# Altium schematic sheet 02-Power.SchDoc: ECE315 Analog
size A; Date: 4/25/2017; ApprovedBy: JSK; CheckedBy: JSK; Author: JSK; CompanyName: University of Wisconsin; DrawnBy: JSK; Engineer: JSK; Organization: ECE 315; Address1: College of Engineering; Address2: 1415 Engineering Drive; Address3: Madison, WI 53706; Address4: ECE 315 Fall 2017; Revision: A; SheetNumber: 2; SheetTotal: 2; AssemblyNumber: ECE315-F19; ApprovedDate: 04/02/2019
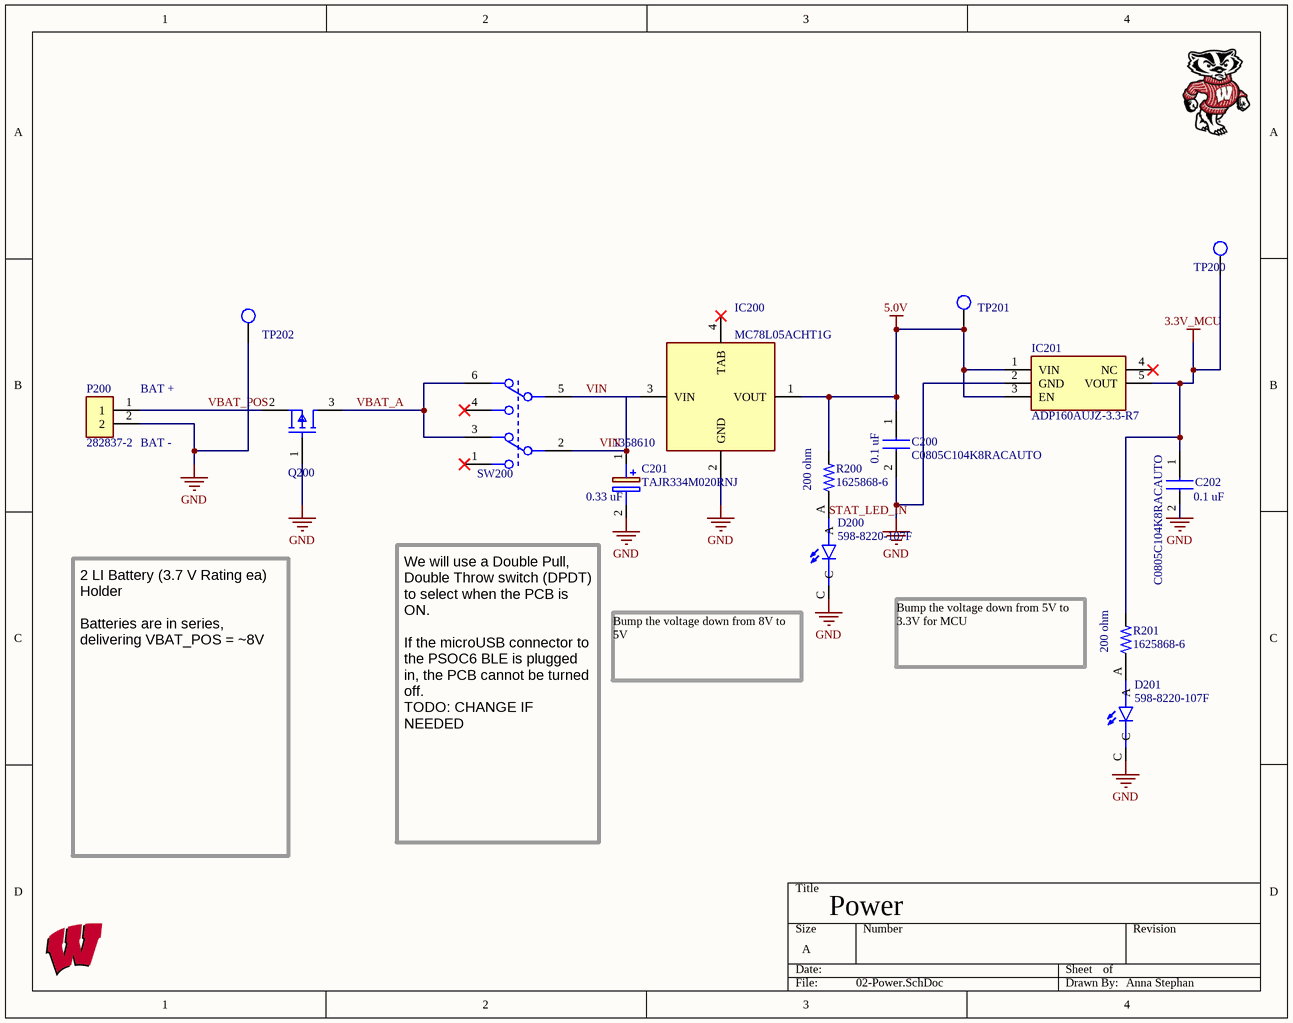
[diagram p0: 02-Power.SchDoc]

## Parts
C200  C0805C104K8RACAUTO  [CAPC2012X88N]
C201  TAJR334M020RNJ  Supplier Part Number 1: 1358610  [CAPM3216X18N]
C202  C0805C104K8RACAUTO  [CAPC2012X88N]
D200  598-8220-107F  [LEDSC160X320X90-2N]
D201  598-8220-107F  [LEDSC160X320X90-2N]
IC200  MC78L05ACHT1G  [SOT89-150P415X160-3N]
IC201  ADP160AUJZ-3.3-R7  [TSOT23127P600-8N]
P200  282837-2  [TE_282837-2]
Q200  SSM3J328R,LF  [SOT-23_M]  (value not drawn)
R200  1625868-6  [RESC2012X65N]
R201  1625868-6  [RESC2012X65N]
SW200  MHS22204  [C&K_Components_0_MFG]  (value not drawn)
TP200  TP_1206  [TP-SMC-1206]  (value not drawn)
TP201  TP_1206  [TP-SMC-1206]  (value not drawn)
TP202  TP_1206  [TP-SMC-1206]  (value not drawn)

## Nets
3.3V_MCU: C202.1 IC201.5(VOUT) R201.2 TP200.1
5.0V: C200.1 IC200.1(VOUT) IC201.1(VIN) IC201.3(EN) R200.2 TP201.1
GND: C200.2 C201.2(-) C202.2 D200.C D201.C IC200.2(GND) IC201.2(GND) P200.2 Q200.1(Gate) TP202.1
VBAT_A: Q200.3(Drain) SW200.3 SW200.6
VBAT_POS: P200.1 Q200.2(Source)
VIN: C201.1(+) IC200.3(VIN) SW200.2 SW200.5
NetD200_A: D200.A R200.1
NetD201_A: D201.A R201.1

Not connected (* = marked no-connect by the designer): IC200 4(TAB)*; IC201 4(NC)*; SW200 1* 4*

## Notes on the sheet
- (near P200) BAT +
- (near P200) BAT -
- (near C201) 0.33 uF
- (near R200) 200 ohm
- (near C200) 0.1 uF
- (near C202) 0.1 uF
- (near D200) Bump the voltage down from 8V to 5V
- Bump the voltage down from 5V to 3.3V for MCU
- (near R201) 200 ohm
- (near C201) We will use a Double Pull, Double Throw switch (DPDT) to select when the PCB is ON.
  If the microUSB connector to the PSOC6 BLE is plugged in, the PCB cannot be turned off.
  TODO: CHANGE IF NEEDED
- 2 LI Battery (3.7 V Rating ea) Holder
  Batteries are in series, delivering VBAT_POS = ~8V
- Power
- Anna Stephan
- Labels drawn without touching a wire or pin: STAT_LED_IN

## Library data of the parts
C200 C202 = C0805C104K8RACAUTO: Capacitor; Manufacturer_Name: Kemet; Datasheet Link: https://ad.componentsearchengine.com/Datasheets/2/C0805C104K8RACAUTO.pdf; Height: 0.88mm; Mouser2 Part Number: 80-C0805C104K8RAUTO; Manufacturer_Part_Number: C0805C104K8RACAUTO
C201 = TAJR334M020RNJ: Capacitor Polarised; Manufacturer_Name: AVX; Height: 1.2mm; Mouser2 Part Number: 581-TAJR334M020RNJ; Manufacturer_Part_Number: TAJR334M020RNJ; Supplier 1: RSComponents
D200 D201 = 598-8220-107F: Red 625nm LED Indication - Discrete 2V 1206 _3216 Metric_; MF: Dialight; Value: *; MP: 598-8220-107F; Package: 1206 Dialight; SnapEDA_Link: https://www.snapeda.com/parts/598-8220-107F/Dialight/view-part/454138/?ref=snap
IC200 = MC78L05ACHT1G: Integrated Circuit; Manufacturer_Name: ON Semiconductor; Datasheet Link: https://componentsearchengine.com//MC78L05ACHT1G.pdf; Mouser2 Part Number: 863-MC78L05ACHT1G; Mouser2 Price/Stock: https://www.mouser.com/Search/Refine.aspx?Keyword=863-MC78L05ACHT1G; Manufacturer_Part_Number: MC78L05ACHT1G
IC201 = ADP160AUJZ-3.0-R7: Integrated Circuit; Manufacturer_Name: Analog Devices; Datasheet Link: https://componentsearchengine.com/Datasheets/2/ADP160AUJZ-3.0-R7.pdf; Height: 1mm; Mouser2 Part Number: 584-ADP160AUJZ-3.3R7; Manufacturer_Part_Number: ADP160AUJZ-3.0-R7
P200 = 282837-2: Connector Terminal Blocks Receptacle 2 Position 5.08mm Solder Straight Thru-Hole 13.5A/Contact; Manufacturer: TE Connectivity AMP Connectors; MF: TE Connectivity; Price: None; Check_prices: https://www.snapeda.com/parts/282837-2/TE%20Connectivity%20AMP%20Connectors/view-part/2549980/?ref=eda; Package: None; Purchase-URL: https://pricing.snapeda.com/search/part/282837-2/?ref=eda; SnapEDA_Link: https://www.snapeda.com/parts/282837-2/TE%20Connectivity%20AMP%20Connectors/view-part/2549980/?ref=snap; Value: *; MP: 282837-2; Availability: Good; Manufacturer Part No.: 282837-2; Digikey Part No.: A113320-ND
Q200 = SSM3J328R,LF: MOSFET P-CH 20V 6A SOT23F; Manufacturer 1: Toshiba; Rds On Max: 29.8mR; Input Capacitance: 840pF; Max Power Dissipation: 1W; Gate to Source Voltage (Vgs): 8V; Turn-Off Delay Time: 107ns; Turn-On Delay Time: 32ns; Number of Channels: 1; Drain to Source Resistance: 47.4mR; Power Dissipation: 2W; Element Configuration: Single; Drain to Source Breakdown Voltage: -20V; Polarity: P-CHANNEL; Supplier 1: Digi-Key; Supplier Part Number 1: SSM3J328RLFCT-ND; Manufacturer Part Number 1: SSM3J328R,LF; RoHS: Yes; Category: MOSFETs; Stock 1: 476474; Pricing 1: 1=0.43000, 10=0.32200, 25=0.29040, 100=0.20060, 500=0.13728, 1000=0.10560 (USD); Mount: Surface Mount; Case/Package: SOT-23-3; Number of Pins: 3; Min Operating Temperature: -55°C; Max Operating Temperature: 150°C; Package Quantity: 3000; Packaging: Tape and Reel; Drain to Source Voltage (Vdss): 20V; Continuous Drain Current (ID): 6A; Number of Elements: 1; Radiation Hardening: No; RoHS Compliant: Yes; ComponentLink1URL: https://datasheet.ciiva.com/11158/ssm3j328r-datasheet-en-20140301-11158652.pdf?src-supplier=Avnet; ComponentLink1Description: https://datasheet.ciiva.com/11158/ssm3j328r-datasheet-en-20140301-11158652.pdf?src-supplier=Avnet; ComponentLink2URL: https://datasheet.ciiva.com/24106/ssm3j328r-datasheet-en-20140301-24106699.pdf?src-supplier=Mouser; ComponentLink2Description: https://datasheet.ciiva.com/24106/ssm3j328r-datasheet-en-20140301-24106699.pdf?src-supplier=Mouser; ComponentLink3URL: https://datasheet.ciiva.com/45425/ssm3j328r-datasheet-en-20140301-45425519.pdf?src-supplier=Digi-Key; ComponentLink3Description: https://datasheet.ciiva.com/45425/ssm3j328r-datasheet-en-20140301-45425519.pdf?src-supplier=Digi-Key; ComponentLink4URL: https://datasheet.ciiva.com/45425/ssm3j328r-datasheet-en-20140301-45425813.pdf?src-supplier=Digi-Key; ComponentLink4Description: https://datasheet.ciiva.com/45425/ssm3j328r-datasheet-en-20140301-45425813.pdf?src-supplier=Digi-Key
R200 R201 = 1625868-6: Resistor 0805 200R 0.1% 25ppm (reel); Package: None; Price: None; Value: *; MP: 1625868-6; Availability: Unavailable
SW200 = JS202011SCQN: C & K COMPONENTS - JS202011SCQN - SWITCH, DPDT, 0.6A, 6VDC, SMD; Manufacturer 1: TE Connectivity; Actuator Material: Nylon,Polyamide,PA46; Actuator Color: Black; Voltage Rating (DC): 6V; Current Rating: 300mA; Electrical Life: 5000Cycles; Switch Function: On-On; Contact Resistance: 70mR; Switch Travel: 2mm; Actuator Type: Standard; Supplier 1: Mouser; Supplier Part Number 1: 506-MHS22204; Manufacturer Part Number 1: MHS22204; RoHS: Yes; Category: Slide Switches; Stock 1: 21096; Pricing 1: 1=0.55000, 10=0.53000, 25=0.51040, 100=0.44180, 250=0.40252, 500=0.37306 (USD); Mount: Surface Mount; Contact Plating: Silver; Contact Material: Copper Alloy; Housing Material: Nylon; Min Operating Temperature: -20°C; Max Operating Temperature: 85°C; Throw Configuration: DPDT; Packaging: Tape and Reel; Package Quantity: 1; Termination: Gull Wing; Max Voltage Rating (DC): 6V; Series: JS; Max Current Rating: 300mA; Contact Current Rating: 300mA; Orientation: Vertical; Length: 9mm; Depth: 7.5mm; Actuator Length: 2mm; Radiation Hardening: No; REACH SVHC: No SVHC; Lead Free: Lead Free; Flammability Rating: UL94 V-2
TP200-TP202 = TP_1206: Test Point SMD 1206; Manufacturer: TE Connectivity (Tyco Electronics); Manufacturer Part Number: 1625854-1; Resistance Value: 0 Ohm; Temperature Coefficient: N/R; Supplier: Digi-Key; Stock 1: 31937; Pricing 1: 1=0.28, 10=0.261, 25=0.224, 50=0.1902, 100=0.1828, 250=0.1641, 500=0.1567, 1000=0.1306 (USD); Case Size: 1206; Dimension: 3.2 x 1.6 x 1.25mm; Family: RC; Mounting: Surface Mount; Operating Temperature: -55 to 125 C; Part No: 1625854-1; RoHS: Yes; Packaging: Tape and Reel; Termination Style: N/R; Terminal Pitch: N/R; Power Rating: N/R; Tolerance: N/R; ComponentLink1URL: https://datasheet.ciiva.com/6439/eng-ds-1773266-a-6439169.pdf; ComponentLink1Description: https://datasheet.ciiva.com/6439/eng-ds-1773266-a-6439169.pdf; ComponentLink2URL: https://datasheet.ciiva.com/30136/1773266-a-30136341.pdf; ComponentLink2Description: https://datasheet.ciiva.com/30136/1773266-a-30136341.pdf; ComponentLink3URL: https://datasheet.ciiva.com/6439/eng-ds-1773266-a-6439080.pdf; ComponentLink3Description: https://datasheet.ciiva.com/6439/eng-ds-1773266-a-6439080.pdf; ComponentLink4URL: https://datasheet.ciiva.com/6439/eng-ds-1773266-a-6439081.pdf; ComponentLink4Description: https://datasheet.ciiva.com/6439/eng-ds-1773266-a-6439081.pdf; ComponentLink5URL: https://datasheet.ciiva.com/6439/eng-ds-1773266-a-6439083.pdf; ComponentLink5Description: https://datasheet.ciiva.com/6439/eng-ds-1773266-a-6439083.pdf; Supplier Part Number: A106143CT-ND